# Altium project SHIELD4.PrjPCB
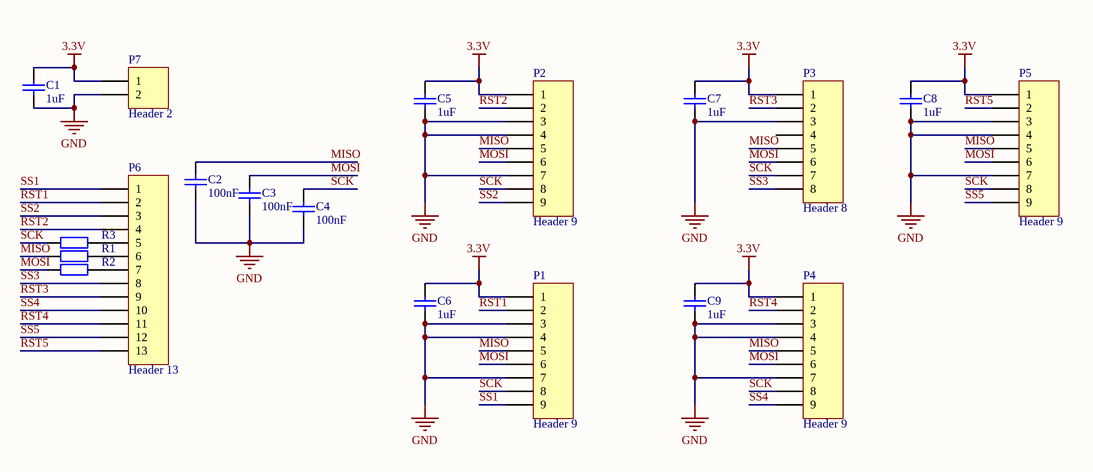
[diagram p0: SHIELD4.SchDoc]
1 sheet, 19 parts. Net scope: global (net labels, ports and power ports of the same name join across sheets).
Board file: PCB4.PcbDoc

## Sheet SHIELD4.SchDoc
size A4

### Parts
C1  value 1uF  [C0805]  (hidden comment: Cap)
C2  value 100nF  [C0805]  (hidden comment: Cap)
C3  value 100nF  [C0805]  (hidden comment: Cap)
C4  value 100nF  [C0805]  (hidden comment: Cap)
C5  value 1uF  [C0805]  (hidden comment: Cap)
C6  value 1uF  [C0805]  (hidden comment: Cap)
C7  value 1uF  [C0805]  (hidden comment: Cap)
C8  value 1uF  [C0805]  (hidden comment: Cap)
C9  value 1uF  [C0805]  (hidden comment: Cap)
P1  Header 9  [HDR1X9]
P2  Header 9  [HDR1X9]
P3  Header 8  [HDR1X8]
P4  Header 9  [HDR1X9]
P5  Header 9  [HDR1X9]
P6  Header 13  [HDR1X13]
P7  Header 2  [HDR1X2]
R1  Res2  [6-0805_N]  (value not drawn)
R2  Res2  [6-0805_N]  (value not drawn)
R3  Res2  [6-0805_N]  (value not drawn)

### Nets
3.3V: C1.2 C5.2 C6.2 C7.2 C8.2 C9.2 P1.1 P2.1 P3.1 P4.1 P5.1 P7.1
GND: C1.1 C2.1 C3.2 C4.2 C5.1 C6.1 C7.1 C8.1 C9.1 P1.3 P1.4 P1.7 P2.3 P2.4 P2.7 P3.3 P4.3 P4.4 P4.7 P5.3 P5.4 P5.7 P7.2
MISO: C2.2 P1.5 P2.5 P3.5 P4.5 P5.5 R1.1
MOSI: C3.1 P1.6 P2.6 P3.6 P4.6 P5.6 R2.1
RST1: P1.2 P6.2
RST2: P2.2 P6.4
RST3: P3.2 P6.9
RST4: P4.2 P6.11
RST5: P5.2 P6.13
SCK: C4.1 P1.8 P2.8 P3.7 P4.8 P5.8 R3.1
SS1: P1.9 P6.1
SS2: P2.9 P6.3
SS3: P3.8 P6.8
SS4: P4.9 P6.10
SS5: P5.9 P6.12
NetP6_5: P6.5 R3.2
NetP6_6: P6.6 R1.2
NetP6_7: P6.7 R2.2

Not connected (* = marked no-connect by the designer): P3 4

### Library data of the parts
C1-C9 = Cap: Capacitor; Published: 8-Jun-2000; LatestRevisionDate: 17-Jul-2002; LatestRevisionNote: Re-released for DXP Platform.; PackageReference: RAD-0.3; Publisher: Altium Limited; PackageDescription: Radial Cap, Thru-Hole; 2 Leads; 0.3 in Pin Spacing
P1 P2 P4 P5 = Header 9: Header, 9-Pin; LatestRevisionDate: 17-Jul-2002; LatestRevisionNote: Re-released for DXP Platform.; Publisher: Altium Limited
P3 = Header 8: Header, 8-Pin; LatestRevisionDate: 17-Jul-2002; LatestRevisionNote: Re-released for DXP Platform.; Publisher: Altium Limited
P6 = Header 13: Header, 13-Pin; LatestRevisionDate: 17-Jul-2002; LatestRevisionNote: Re-released for DXP Platform.; Publisher: Altium Limited
P7 = Header 2: Header, 2-Pin; LatestRevisionDate: 17-Jul-2002; LatestRevisionNote: Re-released for DXP Platform.; Publisher: Altium Limited
R1-R3 = Res2: Resistor; Value: 1K; Published: 8-Jun-2000; LatestRevisionDate: 17-Jul-2002; LatestRevisionNote: Re-released for DXP Platform.; PackageReference: AXIAL-0.4; Publisher: Altium Limited; PackageDescription: Axial Device, Thru-Hole; 2 Leads; 0.4 in Pin Spacing